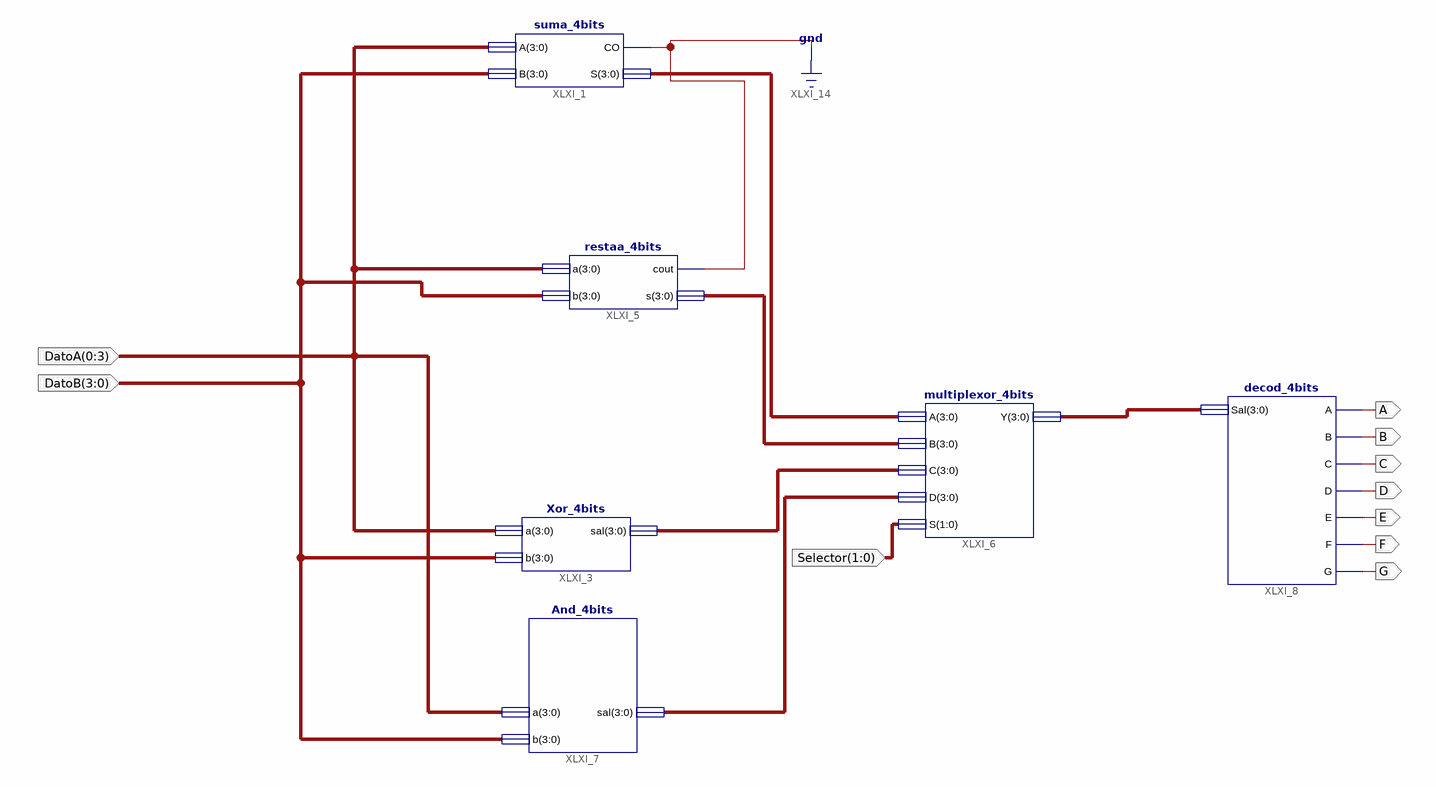
[diagram p0: schematic sheet 1]
// Xilinx ISE schematic Alu_4bits.sch (artix7) as structural Verilog: 6 symbols, 10 ports
module Alu_4bits (
  input  [1:0] Selector,
  input  [0:3] DatoA,
  input  [3:0] DatoB,
  output A,
  output B,
  output C,
  output D,
  output E,
  output F,
  output G
);

  wire [3:0] XLXN_1, XLXN_2, XLXN_3, XLXN_9, XLXN_10;

  suma_4bits XLXI_1 (.A(DatoA), .B(DatoB), .CO(1'b0), .S(XLXN_1));
  Xor_4bits XLXI_3 (.a(DatoA), .b(DatoB), .sal(XLXN_3));
  restaa_4bits XLXI_5 (.a(DatoA), .b(DatoB), .cout(1'b0), .s(XLXN_2));
  multiplexor_4bits XLXI_6 (.A(XLXN_1), .B(XLXN_2), .C(XLXN_3), .D(XLXN_9), .S(Selector), .Y(XLXN_10));
  And_4bits XLXI_7 (.a(DatoA), .b(DatoB), .sal(XLXN_9));
  decod_4bits XLXI_8 (.Sal(XLXN_10), .A(A), .B(B), .C(C), .D(D), .E(E), .F(F), .G(G));
endmodule
